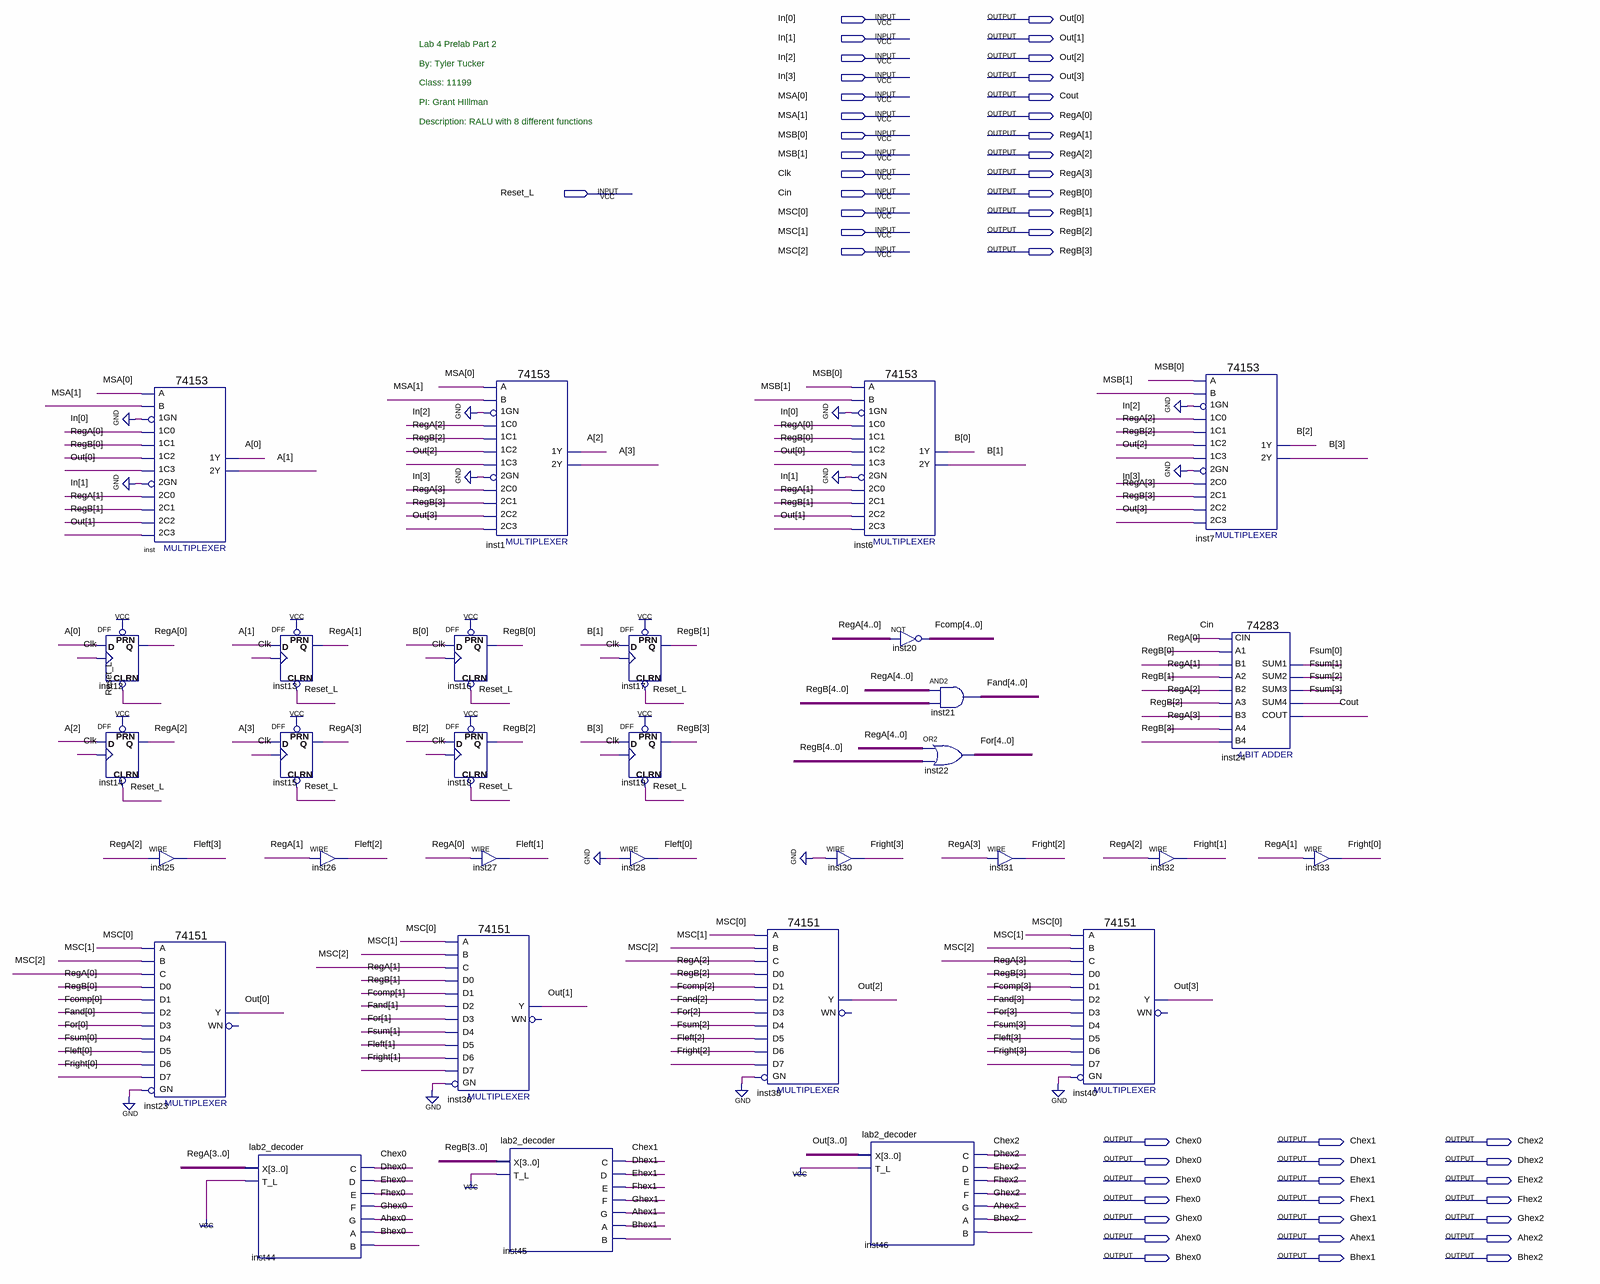
[diagram p0: schematic sheet]
// Quartus schematic lab4_ralu.bdf as structural Verilog: 31 symbols, 48 pins
module lab4_ralu (
  input  [3:0] In,
  input  [1:0] MSA,
  input  [1:0] MSB,
  input  Clk,
  input  Reset_L,
  input  Cin,
  input  [2:0] MSC,
  output [3:0] Out,
  output Cout,
  output [4:0] RegA,
  output [4:0] RegB,
  output Chex0,
  output Chex1,
  output Chex2,
  output Dhex0,
  output Dhex1,
  output Dhex2,
  output Ehex0,
  output Ehex1,
  output Ehex2,
  output Fhex0,
  output Fhex1,
  output Fhex2,
  output Ghex0,
  output Ghex1,
  output Ghex2,
  output Ahex0,
  output Ahex1,
  output Ahex2,
  output Bhex0,
  output Bhex1,
  output Bhex2
);

  wire [3:0] A, B, Fleft, Fright, Fsum;
  wire [4:0] Fand, Fcomp, For;

  DFF inst12 (.CLRN(Reset_L), .CLK(Clk), .D(A[0]), .PRN(1'b1), .Q(RegA[0]));
  DFF inst14 (.CLK(Clk), .D(A[2]), .PRN(1'b1), .Q(RegA[2]));  // open: CLRN
  \74153  inst (
    .\1C1 (RegA[0]), .\1GN (1'b0), .\1C0 (In[0]), .\2C0 (In[1]), .\2GN (1'b0), .\2C2 (RegB[1]),
    .\1C2 (RegB[0]), .\1C3 (Out[0]), .B(MSA[1]), .A(MSA[0]), .\2C1 (RegA[1]), .\2C3 (Out[1]), .\1Y (A[0]),
    .\2Y (A[1]));
  assign Fleft[3] = RegA[2];  // WIRE inst25
  \74151  inst23 (
    .GN(1'b0), .C(MSC[2]), .B(MSC[1]), .A(MSC[0]), .D5(Fsum[0]), .D0(RegA[0]), .D1(RegB[0]), .D4(For[0]),
    .D3(Fand[0]), .D2(Fcomp[0]), .D6(Fleft[0]), .D7(Fright[0]), .Y(Out[0]));  // open: WN
  lab2_decoder inst44 (
    .X(RegA[3:0]), .T_L(1'b1), .C(Chex0), .D(Dhex0), .E(Ehex0), .F(Fhex0), .G(Ghex0), .A(Ahex0), .B(Bhex0));
  DFF inst13 (.CLRN(Reset_L), .CLK(Clk), .D(A[1]), .PRN(1'b1), .Q(RegA[1]));
  DFF inst15 (.CLRN(Reset_L), .CLK(Clk), .D(A[3]), .PRN(1'b1), .Q(RegA[3]));
  assign Fleft[2] = RegA[1];  // WIRE inst26
  DFF inst16 (.CLRN(Reset_L), .CLK(Clk), .D(B[0]), .PRN(1'b1), .Q(RegB[0]));
  DFF inst18 (.CLRN(Reset_L), .CLK(Clk), .D(B[2]), .PRN(1'b1), .Q(RegB[2]));
  \74151  inst36 (
    .GN(1'b0), .C(MSC[2]), .B(MSC[1]), .A(MSC[0]), .D5(Fsum[1]), .D0(RegA[1]), .D1(RegB[1]), .D4(For[1]),
    .D3(Fand[1]), .D2(Fcomp[1]), .D6(Fleft[1]), .D7(Fright[1]), .Y(Out[1]));  // open: WN
  \74153  inst1 (
    .\1C1 (RegA[2]), .\1GN (1'b0), .\1C0 (In[2]), .\2C0 (In[3]), .\2GN (1'b0), .\2C2 (RegB[3]),
    .\1C2 (RegB[2]), .\1C3 (Out[2]), .B(MSA[1]), .A(MSA[0]), .\2C1 (RegA[3]), .\2C3 (Out[3]), .\1Y (A[2]),
    .\2Y (A[3]));
  assign Fleft[1] = RegA[0];  // WIRE inst27
  lab2_decoder inst45 (
    .X(RegB[3:0]), .T_L(1'b1), .C(Chex1), .D(Dhex1), .E(Ehex1), .F(Fhex1), .G(Ghex1), .A(Ahex1), .B(Bhex1));
  DFF inst17 (.CLRN(Reset_L), .CLK(Clk), .D(B[1]), .PRN(1'b1), .Q(RegB[1]));
  DFF inst19 (.CLRN(Reset_L), .CLK(Clk), .D(B[3]), .PRN(1'b1), .Q(RegB[3]));
  assign Fleft[0] = 1'b0;  // WIRE inst28
  \74151  inst38 (
    .GN(1'b0), .C(MSC[2]), .B(MSC[1]), .A(MSC[0]), .D5(Fsum[2]), .D0(RegA[2]), .D1(RegB[2]), .D4(For[2]),
    .D3(Fand[2]), .D2(Fcomp[2]), .D6(Fleft[2]), .D7(Fright[2]), .Y(Out[2]));  // open: WN
  \74153  inst6 (
    .\1C1 (RegA[0]), .\1GN (1'b0), .\1C0 (In[0]), .\2C0 (In[1]), .\2GN (1'b0), .\2C2 (RegB[1]),
    .\1C2 (RegB[0]), .\1C3 (Out[0]), .B(MSB[1]), .A(MSB[0]), .\2C1 (RegA[1]), .\2C3 (Out[1]), .\1Y (B[0]),
    .\2Y (B[1]));
  assign Fright[3] = 1'b0;  // WIRE inst30
  lab2_decoder inst46 (
    .X(Out), .T_L(1'b1), .C(Chex2), .D(Dhex2), .E(Ehex2), .F(Fhex2), .G(Ghex2), .A(Ahex2), .B(Bhex2));
  assign Fcomp = ~RegA;  // NOT inst20, 5 bits wide
  assign For = RegA | RegB;  // OR2 inst22, 5 bits wide
  assign Fand = RegA & RegB;  // AND2 inst21, 5 bits wide
  assign Fright[2] = RegA[3];  // WIRE inst31
  \74151  inst40 (
    .GN(1'b0), .C(MSC[2]), .B(MSC[1]), .A(MSC[0]), .D5(Fsum[3]), .D0(RegA[3]), .D1(RegB[3]), .D4(For[3]),
    .D3(Fand[3]), .D2(Fcomp[3]), .D6(Fleft[3]), .D7(Fright[3]), .Y(Out[3]));  // open: WN
  assign Fright[1] = RegA[2];  // WIRE inst32
  \74153  inst7 (
    .\1C1 (RegA[2]), .\1GN (1'b0), .\1C0 (In[2]), .\2C0 (In[3]), .\2GN (1'b0), .\2C2 (RegB[3]),
    .\1C2 (RegB[2]), .\1C3 (Out[2]), .B(MSB[1]), .A(MSB[0]), .\2C1 (RegA[3]), .\2C3 (Out[3]), .\1Y (B[2]),
    .\2Y (B[3]));
  \74283  inst24 (
    .CIN(Cin), .A1(RegA[0]), .A2(RegA[1]), .B2(RegB[1]), .A3(RegA[2]), .A4(RegA[3]), .B4(RegB[3]),
    .B1(RegB[0]), .B3(RegB[2]), .SUM4(Fsum[3]), .COUT(Cout), .SUM1(Fsum[0]), .SUM2(Fsum[1]), .SUM3(Fsum[2]));
  assign Fright[0] = RegA[1];  // WIRE inst33

  // Notes on the sheet:
  //   Lab 4 Prelab Part 2
  //   By: Tyler Tucker
  //   Class: 11199
  //   PI: Grant HIllman
  //   Description: RALU with 8 different functions
endmodule
